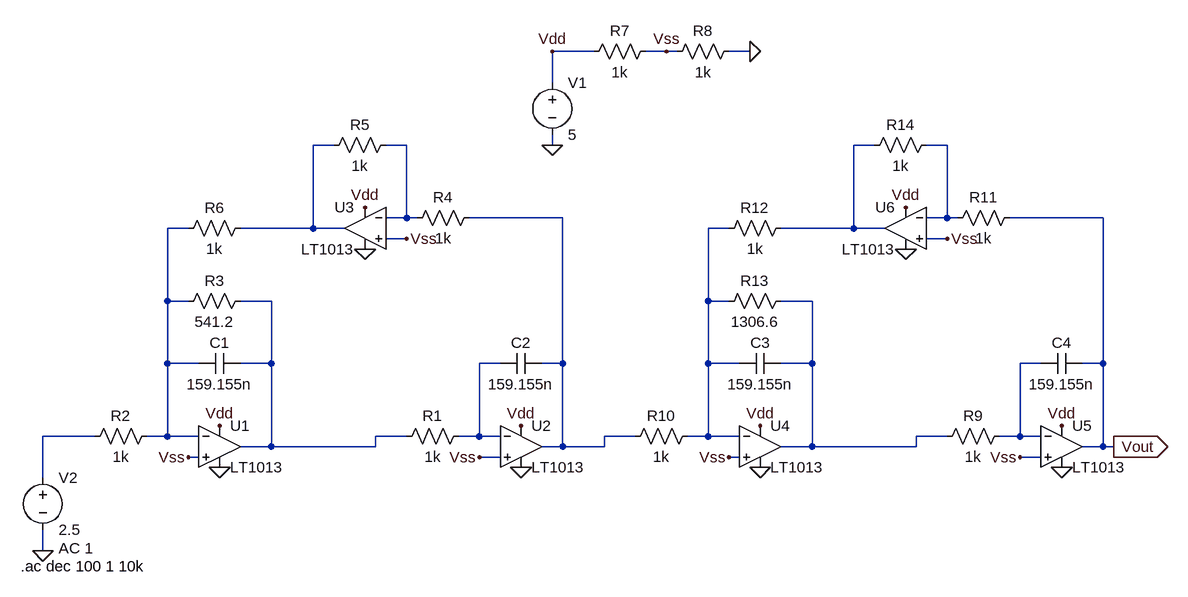
[diagram p0: schematic Maximally flat RC filter.asc]
Maximally flat RC filter.asc, the LTspice schematic file:
Version 4
SHEET 1 1408 680
WIRE 496 -272 432 -272
WIRE 608 -272 576 -272
WIRE 624 -272 608 -272
WIRE 736 -272 704 -272
WIRE 432 -224 432 -272
WIRE 96 -128 64 -128
WIRE 208 -128 176 -128
WIRE 432 -128 432 -144
WIRE 928 -128 896 -128
WIRE 1040 -128 1008 -128
WIRE 208 -16 208 -128
WIRE 208 -16 176 -16
WIRE 224 -16 208 -16
WIRE 448 -16 304 -16
WIRE 1040 -16 1040 -128
WIRE 1040 -16 1008 -16
WIRE 1056 -16 1040 -16
WIRE 1280 -16 1136 -16
WIRE -128 0 -160 0
WIRE 64 0 64 -128
WIRE 64 0 -48 0
WIRE 112 0 64 0
WIRE 704 0 672 0
WIRE 896 0 896 -128
WIRE 896 0 784 0
WIRE 944 0 896 0
WIRE 208 16 176 16
WIRE 1040 16 1008 16
WIRE -160 112 -160 0
WIRE -128 112 -160 112
WIRE 0 112 -48 112
WIRE 672 112 672 0
WIRE 704 112 672 112
WIRE 832 112 784 112
WIRE -160 208 -160 112
WIRE -112 208 -160 208
WIRE 0 208 0 112
WIRE 0 208 -48 208
WIRE 352 208 320 208
WIRE 448 208 448 -16
WIRE 448 208 416 208
WIRE 672 208 672 112
WIRE 720 208 672 208
WIRE 832 208 832 112
WIRE 832 208 784 208
WIRE 1184 208 1152 208
WIRE 1280 208 1280 -16
WIRE 1280 208 1248 208
WIRE -272 320 -352 320
WIRE -160 320 -160 208
WIRE -160 320 -192 320
WIRE -112 320 -160 320
WIRE 208 320 160 320
WIRE 320 320 320 208
WIRE 320 320 288 320
WIRE 352 320 320 320
WIRE 560 320 512 320
WIRE 672 320 672 208
WIRE 672 320 640 320
WIRE 720 320 672 320
WIRE 1040 320 992 320
WIRE 1152 320 1152 208
WIRE 1152 320 1120 320
WIRE 1184 320 1152 320
WIRE 0 336 0 208
WIRE 0 336 -48 336
WIRE 160 336 160 320
WIRE 160 336 0 336
WIRE 448 336 448 208
WIRE 448 336 416 336
WIRE 512 336 512 320
WIRE 512 336 448 336
WIRE 832 336 832 208
WIRE 832 336 784 336
WIRE 992 336 992 320
WIRE 992 336 832 336
WIRE 1280 336 1280 208
WIRE 1280 336 1248 336
WIRE 1296 336 1280 336
WIRE -112 352 -128 352
WIRE 352 352 320 352
WIRE 720 352 704 352
WIRE 1184 352 1152 352
WIRE -352 384 -352 320
WIRE -352 496 -352 464
FLAG 432 -128 0
FLAG 736 -272 0
FLAG 432 -272 Vdd
FLAG 144 -32 Vdd
FLAG 384 304 Vdd
FLAG -80 304 Vdd
FLAG 608 -272 Vss
FLAG 208 16 Vss
FLAG 320 352 Vss
FLAG -128 352 Vss
FLAG 144 32 0
FLAG 384 368 0
FLAG -80 368 0
FLAG 976 -32 Vdd
FLAG 1216 304 Vdd
FLAG 752 304 Vdd
FLAG 1040 16 Vss
FLAG 1152 352 Vss
FLAG 704 352 Vss
FLAG 976 32 0
FLAG 1216 368 0
FLAG 752 368 0
FLAG -352 496 0
FLAG 1296 336 Vout
IOPIN 1296 336 Out
SYMBOL Opamps\\LT1013 -80 272 R0
SYMATTR InstName U1
SYMBOL Opamps\\LT1013 384 272 R0
SYMATTR InstName U2
SYMBOL res 304 304 R90
WINDOW 0 0 56 VBottom 2
WINDOW 3 32 56 VTop 2
SYMATTR InstName R1
SYMATTR Value 1k
SYMBOL res -176 304 R90
WINDOW 0 0 56 VBottom 2
WINDOW 3 32 56 VTop 2
SYMATTR InstName R2
SYMATTR Value 1k
SYMBOL Opamps\\LT1013 144 -64 M0
SYMATTR InstName U3
SYMBOL res 320 -32 R90
WINDOW 0 0 56 VBottom 2
WINDOW 3 32 56 VTop 2
SYMATTR InstName R4
SYMATTR Value 1k
SYMBOL res -32 -16 R90
WINDOW 0 0 56 VBottom 2
WINDOW 3 32 56 VTop 2
SYMATTR InstName R6
SYMATTR Value 1k
SYMBOL voltage 432 -240 R0
WINDOW 123 0 0 Left 0
WINDOW 39 0 0 Left 0
SYMATTR InstName V1
SYMATTR Value 5
SYMBOL res 592 -288 R90
WINDOW 0 0 56 VBottom 2
WINDOW 3 32 56 VTop 2
SYMATTR InstName R7
SYMATTR Value 1k
SYMBOL res 720 -288 R90
WINDOW 0 0 56 VBottom 2
WINDOW 3 32 56 VTop 2
SYMATTR InstName R8
SYMATTR Value 1k
SYMBOL cap -48 192 R90
WINDOW 0 0 32 VBottom 2
WINDOW 3 32 32 VTop 2
SYMATTR InstName C1
SYMATTR Value 159.155n
SYMBOL res -32 96 R90
WINDOW 0 0 56 VBottom 2
WINDOW 3 32 56 VTop 2
SYMATTR InstName R3
SYMATTR Value 541.2
SYMBOL cap 416 192 R90
WINDOW 0 0 32 VBottom 2
WINDOW 3 32 32 VTop 2
SYMATTR InstName C2
SYMATTR Value 159.155n
SYMBOL res 192 -144 R90
WINDOW 0 0 56 VBottom 2
WINDOW 3 32 56 VTop 2
SYMATTR InstName R5
SYMATTR Value 1k
SYMBOL Opamps\\LT1013 752 272 R0
SYMATTR InstName U4
SYMBOL Opamps\\LT1013 1216 272 R0
SYMATTR InstName U5
SYMBOL res 1136 304 R90
WINDOW 0 0 56 VBottom 2
WINDOW 3 32 56 VTop 2
SYMATTR InstName R9
SYMATTR Value 1k
SYMBOL res 656 304 R90
WINDOW 0 0 56 VBottom 2
WINDOW 3 32 56 VTop 2
SYMATTR InstName R10
SYMATTR Value 1k
SYMBOL Opamps\\LT1013 976 -64 M0
SYMATTR InstName U6
SYMBOL res 1152 -32 R90
WINDOW 0 0 56 VBottom 2
WINDOW 3 32 56 VTop 2
SYMATTR InstName R11
SYMATTR Value 1k
SYMBOL res 800 -16 R90
WINDOW 0 0 56 VBottom 2
WINDOW 3 32 56 VTop 2
SYMATTR InstName R12
SYMATTR Value 1k
SYMBOL cap 784 192 R90
WINDOW 0 0 32 VBottom 2
WINDOW 3 32 32 VTop 2
SYMATTR InstName C3
SYMATTR Value 159.155n
SYMBOL res 800 96 R90
WINDOW 0 0 56 VBottom 2
WINDOW 3 32 56 VTop 2
SYMATTR InstName R13
SYMATTR Value 1306.6
SYMBOL cap 1248 192 R90
WINDOW 0 0 32 VBottom 2
WINDOW 3 32 32 VTop 2
SYMATTR InstName C4
SYMATTR Value 159.155n
SYMBOL res 1024 -144 R90
WINDOW 0 0 56 VBottom 2
WINDOW 3 32 56 VTop 2
SYMATTR InstName R14
SYMATTR Value 1k
SYMBOL voltage -352 368 R0
WINDOW 123 24 124 Left 2
WINDOW 39 0 0 Left 0
SYMATTR InstName V2
SYMATTR Value 2.5
SYMATTR Value2 AC 1
TEXT -386 520 Left 2 !.ac dec 100 1 10k

The netlist it stands for:
* Maximally flat RC filter.asc
XU1 Vss N006 Vdd 0 N008 LT1013  ; pins In+ In- V+ V- OUT
XU2 Vss N010 Vdd 0 N005 LT1013  ; pins In+ In- V+ V- OUT
R1 N010 N008 1k
R2 N006 N012 1k
XU3 Vss N002 Vdd 0 N001 LT1013  ; pins In+ In- V+ V- OUT
R4 N005 N002 1k
R6 N001 N006 1k
V1 Vdd 0 5
R7 Vss Vdd 1k
R8 0 Vss 1k
C1 N008 N006 159.155n
R3 N008 N006 541.2
C2 N005 N010 159.155n
R5 N002 N001 1k
XU4 Vss N007 Vdd 0 N009 LT1013  ; pins In+ In- V+ V- OUT
XU5 Vss N011 Vdd 0 Vout LT1013  ; pins In+ In- V+ V- OUT
R9 N011 N009 1k
R10 N007 N005 1k
XU6 Vss N004 Vdd 0 N003 LT1013  ; pins In+ In- V+ V- OUT
R11 Vout N004 1k
R12 N003 N007 1k
C3 N009 N007 159.155n
R13 N009 N007 1306.6
C4 Vout N011 159.155n
R14 N004 N003 1k
V2 N012 0 2.5 AC 1
.ac dec 100 1 10k
.lib LTC.lib
.backanno
.end